# EAGLE schematic logic-UHF (EAGLE 9.2.2)
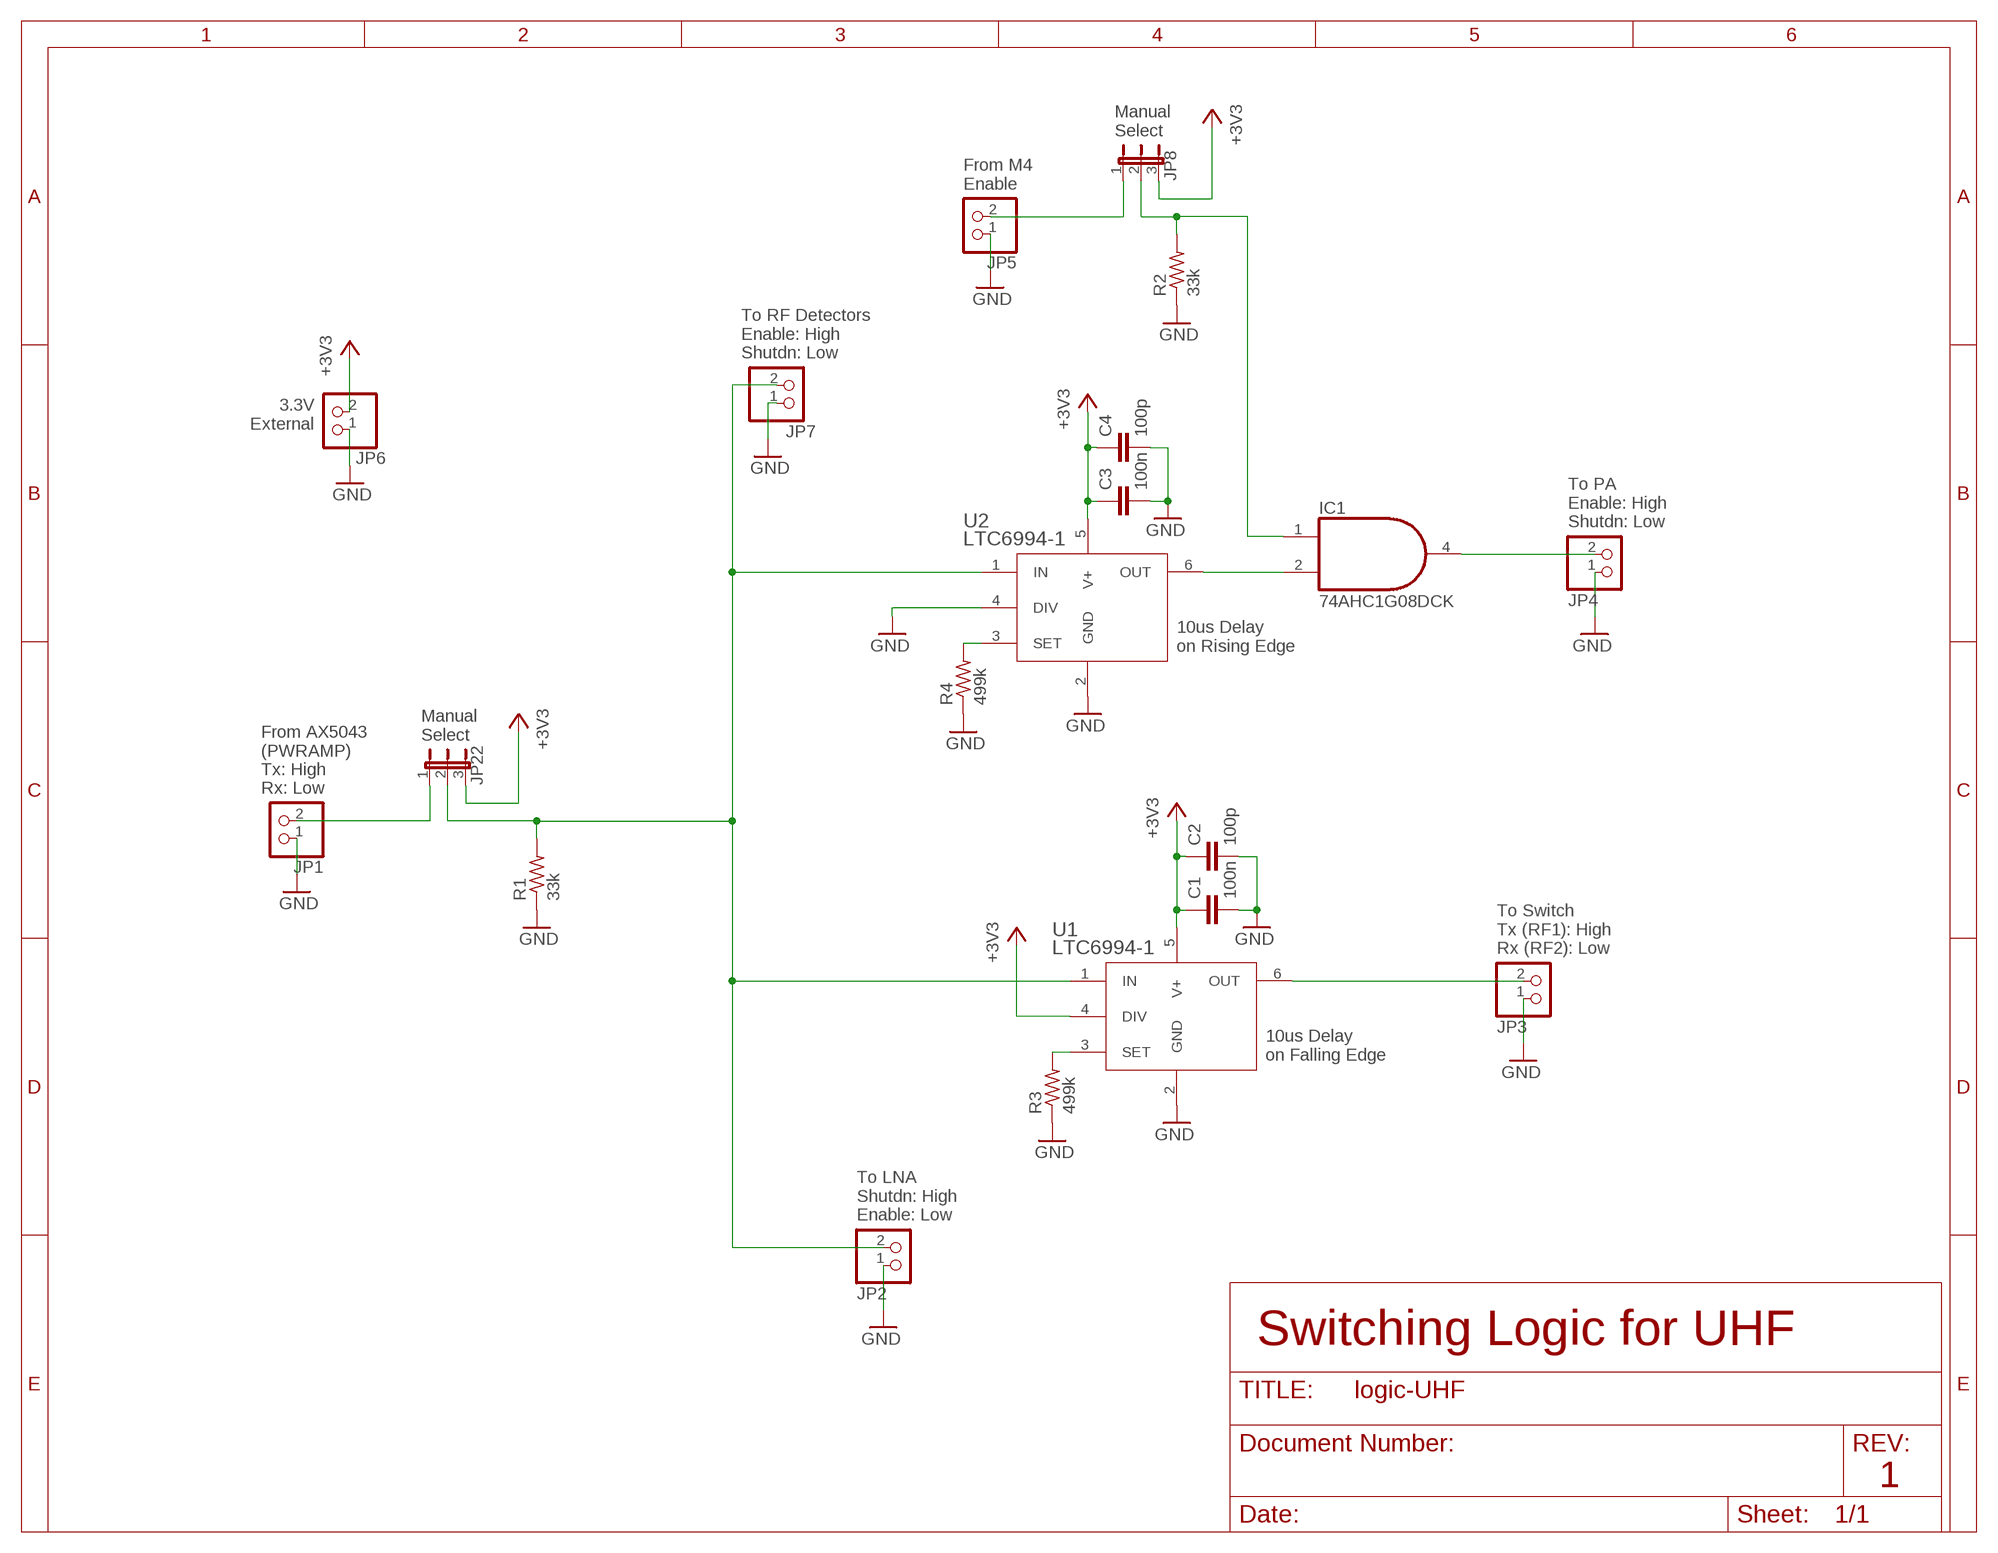
[diagram p0: schematic, sheet 1]

## Parts
C1  100n  C-EU0603-B-NOSILK  [.0603-B-NOSILK]
C2  100p  C-EU0603-B-NOSILK  [.0603-B-NOSILK]
C3  100n  C-EU0603-B-NOSILK  [.0603-B-NOSILK]
C4  100p  C-EU0603-B-NOSILK  [.0603-B-NOSILK]
IC1  74AHC1G08DCK  [SC70-5]
JP1  PINHD-1X2  [1X02]
JP2  PINHD-1X2  [1X02]
JP3  PINHD-1X2  [1X02]
JP4  PINHD-1X2  [1X02]
JP5  PINHD-1X2  [1X02]
JP6  PINHD-1X2  [1X02]
JP7  PINHD-1X2  [1X02]
JP8  JP2E  [JP2]
JP22  JP2E  [JP2]
R1  33k  R-US_0603-B-NOSILK  [.0603-B-NOSILK]
R2  33k  R-US_0603-B-NOSILK  [.0603-B-NOSILK]
R3  499k  R-US_0603-B-NOSILK  [.0603-B-NOSILK]
R4  499k  R-US_0603-B-NOSILK  [.0603-B-NOSILK]
U1  LTC6994-1  LTC6994CS6-1PBF  [TSOT-23_S6]
U2  LTC6994-1  LTC6994CS6-1PBF  [TSOT-23_S6]

## Nets
+3V3: C1.1 C2.1 C3.1 C4.1 JP6.2 JP8.3 JP22.3 U1.4(DIV) U1.5(V+) U2.5(V+)
GND: C1.2 C2.2 C3.2 C4.2 JP1.1 JP2.1 JP3.1 JP4.1 JP5.1 JP6.1 JP7.1 R1.1 R2.1 R3.1 R4.1 U1.2(GND) U2.2(GND) U2.4(DIV)
N$1: JP2.2 JP7.2 JP22.2 R1.2 U1.1(IN) U2.1(IN)
N$2: IC1.4(O) JP4.2
N$3: IC1.2(I1) U2.6(OUT)
N$4: IC1.1(I0) JP8.2 R2.2
N$5: JP3.2 U1.6(OUT)
N$6: JP1.2 JP22.1
N$7: R3.2 U1.3(SET)
N$8: R4.2 U2.3(SET)
N$10: JP5.2 JP8.1

## Notes on the sheet
- Manual
  Select
- From M4
  Enable
- To RF Detectors
  Enable: High
  Shutdn: Low
- 3.3V
  External
- To PA
  Enable: High
  Shutdn: Low
- 10us Delay
  on Rising Edge
- Manual
  Select
- From AX5043
  (PWRAMP)
  Tx: High
  Rx: Low
- To Switch
  Tx (RF1): High
  Rx (RF2): Low
- 10us Delay
  on Falling Edge
- To LNA
  Shutdn: High
  Enable: Low
- Switching Logic for UHF
- 1

## Power pins joined to a net without a drawn wire
GND: IC1.3(GND)
VCC: IC1.5(VCC)

## Library data of the parts
C1-C4 = oresat-rcl:C-EU: CAPACITOR, European symbol
IC1 = 74xx-little-us:74*1G08: 2-input AND gate
JP1-JP7 = pinhead:PINHD-1X2: PIN HEADER
JP8 JP22 = jumper:JP2E: JUMPER
R1-R4 = oresat-rcl:R-US_: RESISTOR, American symbol
U1 U2 = U-Linear-LTC6994CS6-1-programable-delay:LTC6994CS6-1PBF; MFR: Linear Technology; MPN: LTC6994-1